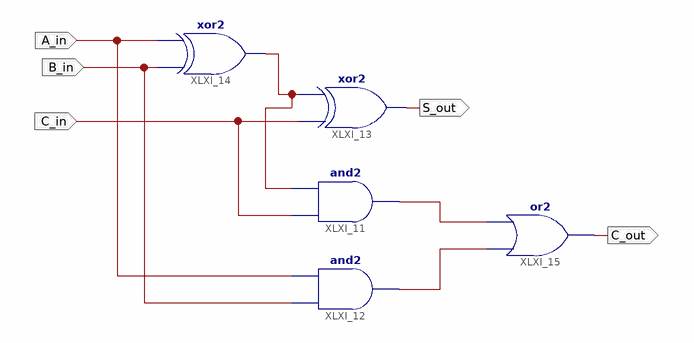
[diagram p0: schematic sheet 1]
// Xilinx ISE schematic fulladd.sch (spartan6) as structural Verilog: 5 symbols, 5 ports
module fulladd (
  input  A_in,
  input  B_in,
  input  C_in,
  output S_out,
  output C_out
);

  wire XLXN_1, XLXN_2, XLXN_3;

  and XLXI_11 (XLXN_1, C_in, XLXN_3);
  and XLXI_12 (XLXN_2, B_in, A_in);
  xor XLXI_13 (S_out, C_in, XLXN_3);
  xor XLXI_14 (XLXN_3, B_in, A_in);
  or XLXI_15 (C_out, XLXN_2, XLXN_1);
endmodule
